# EAGLE schematic BMS_watchdog (EAGLE 7.7.0)
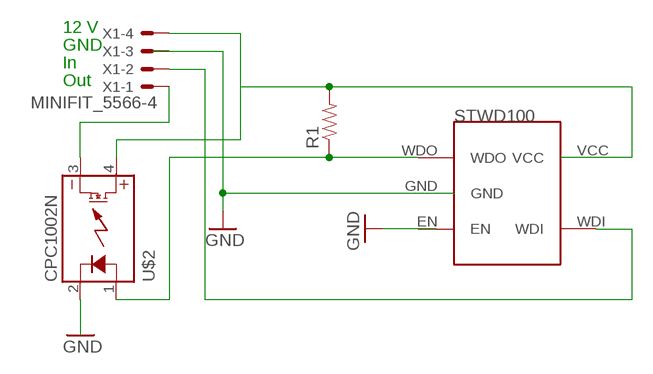
[diagram p0: schematic, sheet 1]

## Parts
R1  RESISTOR0805-RES  [0805]
U$1  STWD100  [SOT23-5]
U$2  CPC1002N  [SOP04]
X1  MINIFIT_5566-4  [MINIFIT_5566-4]

## Nets
N$1: R1.2 U$2.4(DC+) X1.4
N$2: U$1.WDI X1.2
N$3: R1.1 U$1.WDO U$2.1(CONTROL+)
N$5: U$2.3(DC-) X1.1
N$6: U$2.2(CONTROL-)
Unconnected: U$1.EN U$1.GND U$1.VCC X1.3

## Notes on the sheet
- 12 V
- GND
- In
- Out

## Library data of the parts
R1 = HyTechDevices:RESISTOR: Resistor Basic schematic elements and footprints for 0603, 1206, and PTH resistors.
U$1 = HyTechDevices:STWD100: STWD100 Watchdog timer
U$2 = HyTechDevices:CPC1002N: IXYS Solid State Relay .7A
X1 = HyTechDevices:MINIFIT_5566-4: Mini-Fit Junior connector 4 pole Source: http://www.molex.com; OC_FARNELL: unknown; OC_NEWARK: unknown